# EAGLE board mycodo board 2.0 (EAGLE 9.6.2), part 1 of 2
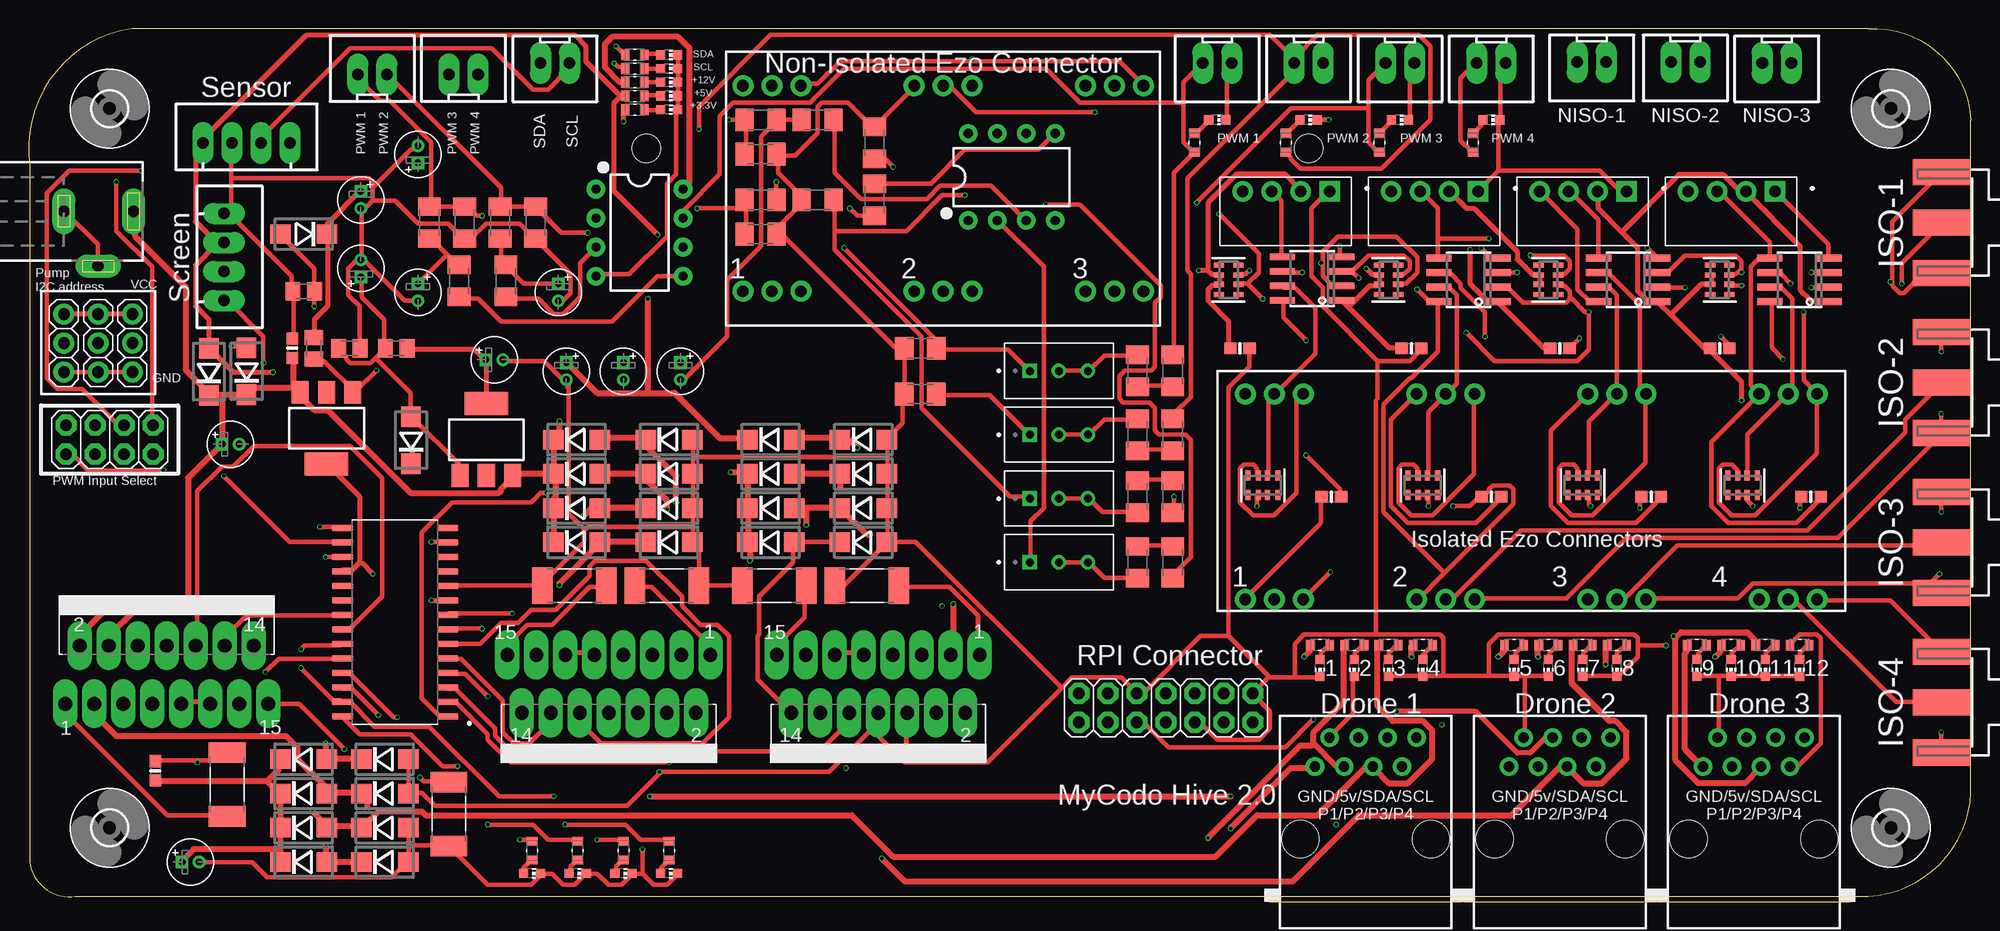
[diagram p2: board, top side]
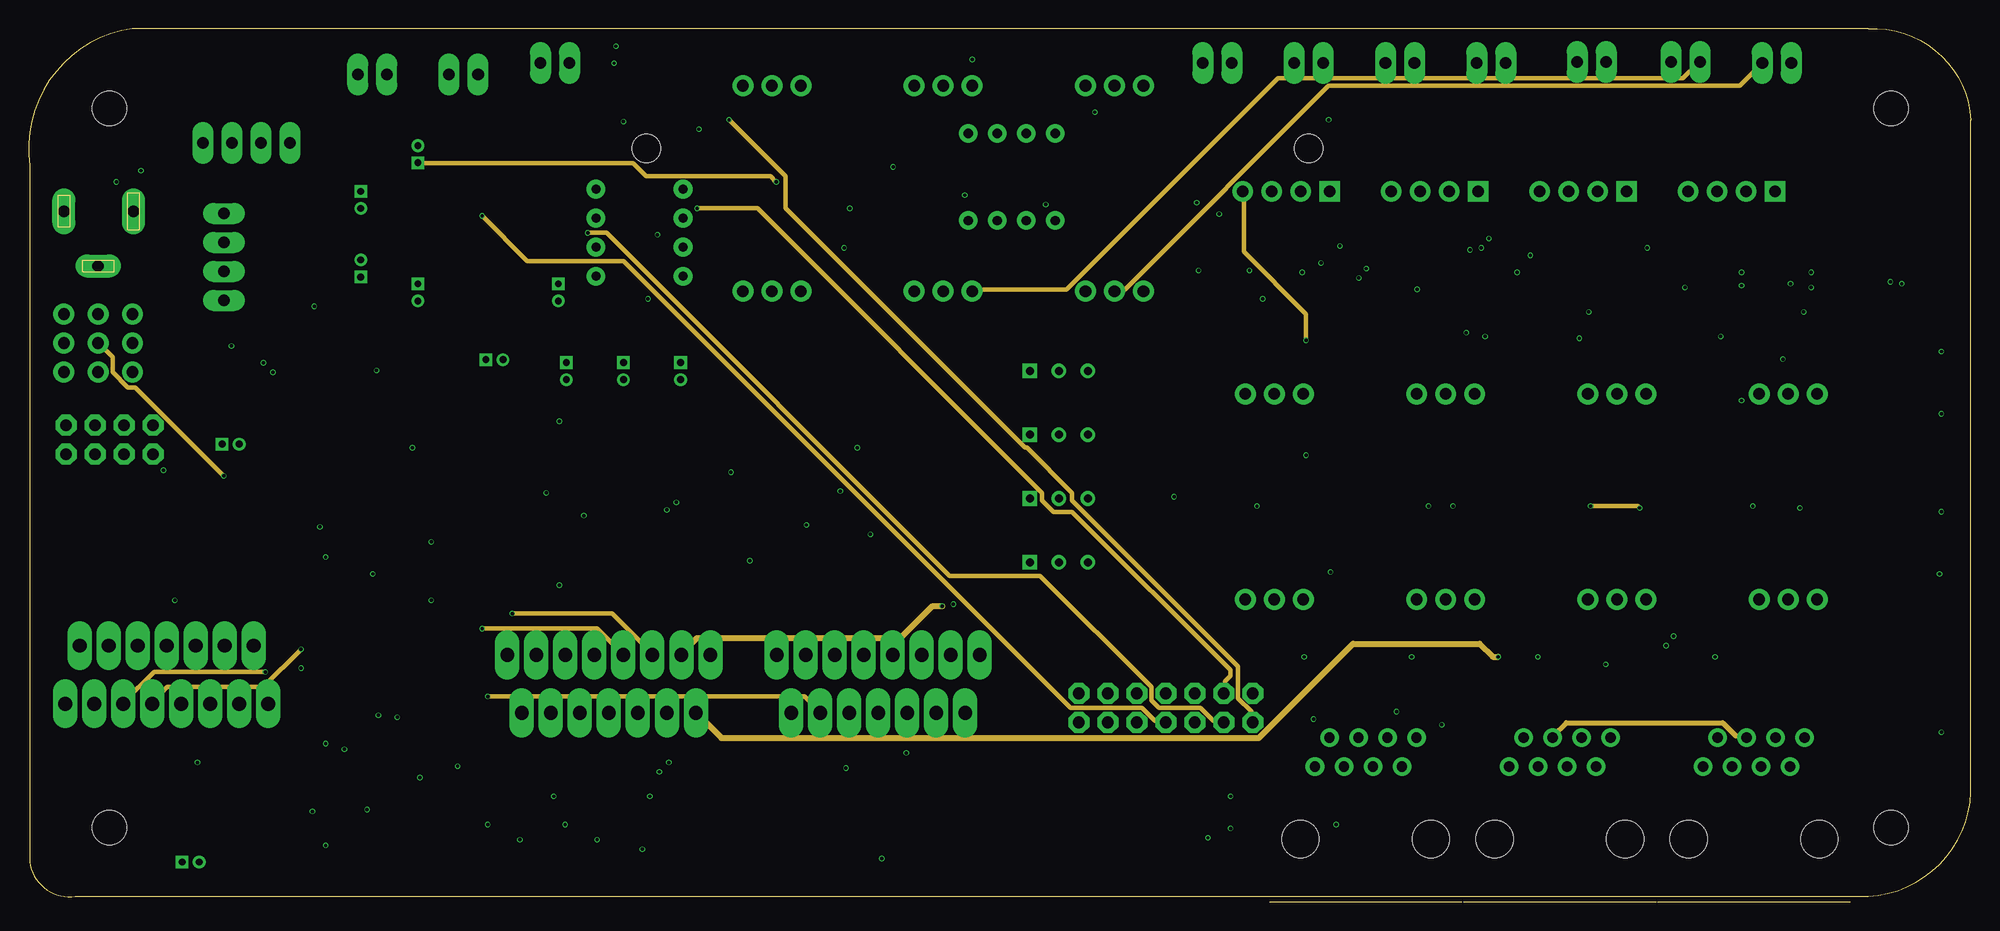
[diagram p3: board, inner layer Route2]
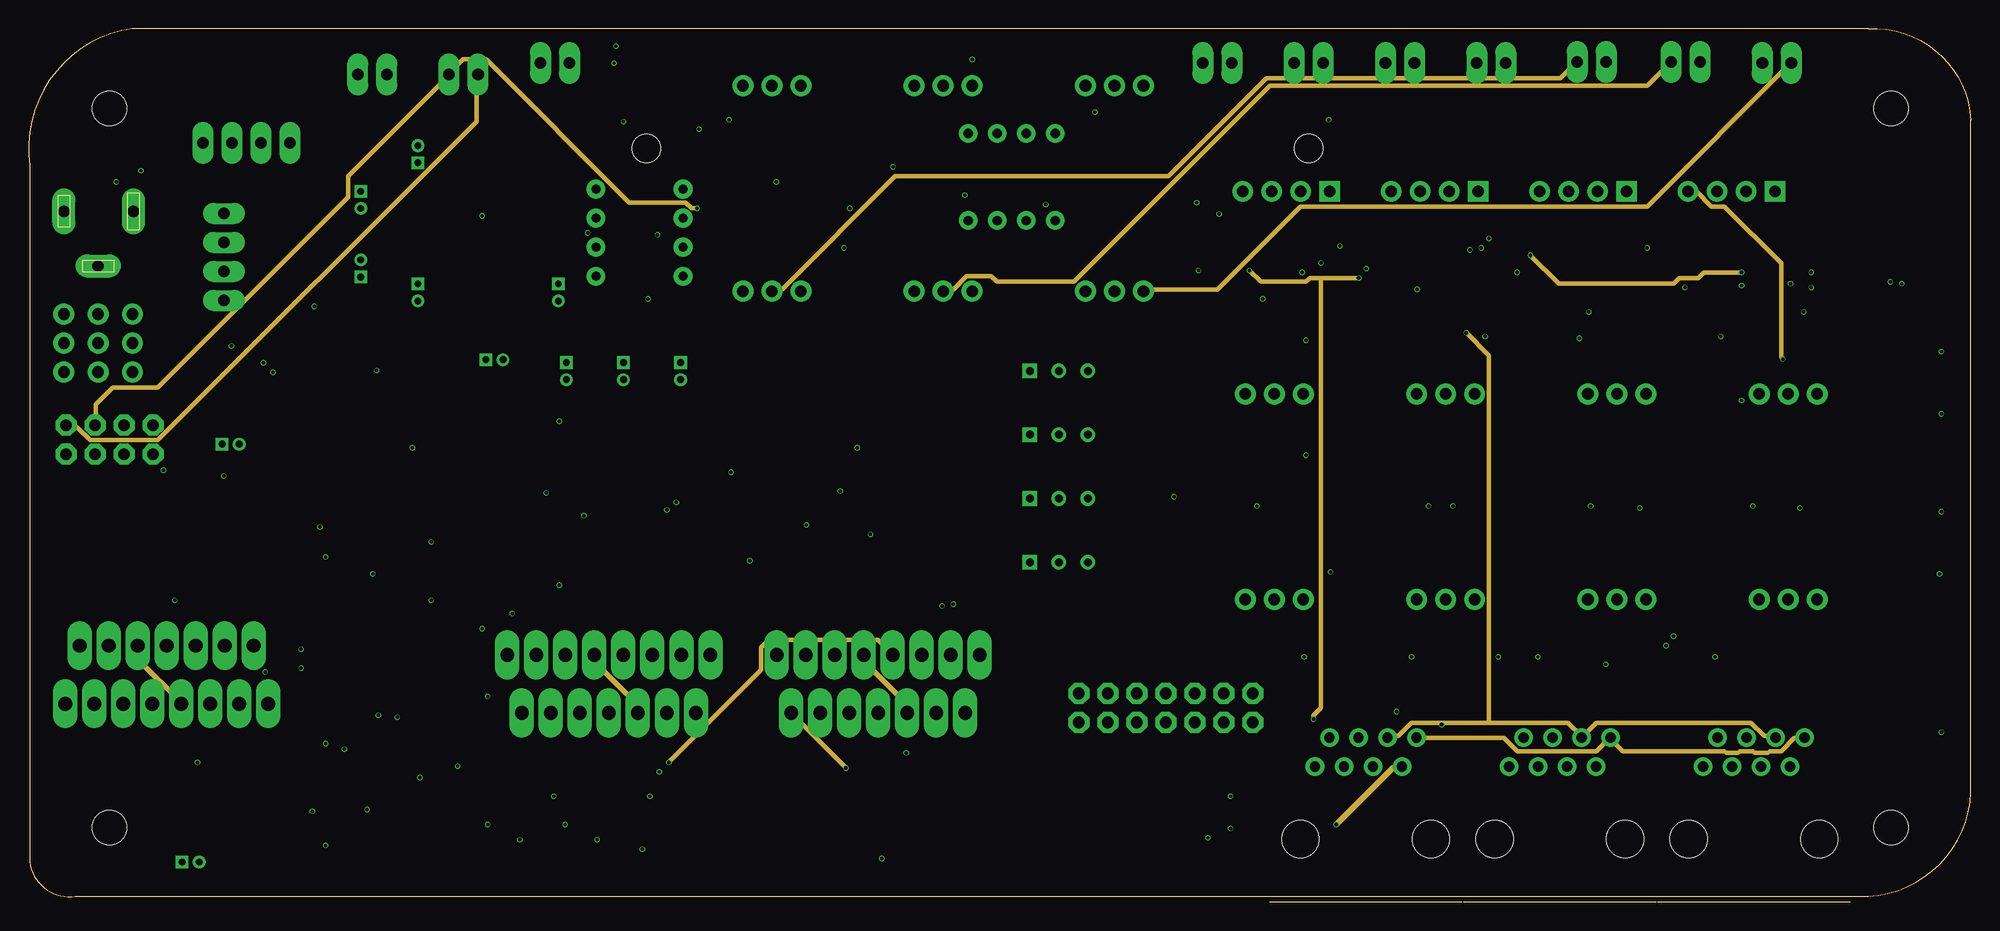
[diagram p4: board, inner layer Route15]
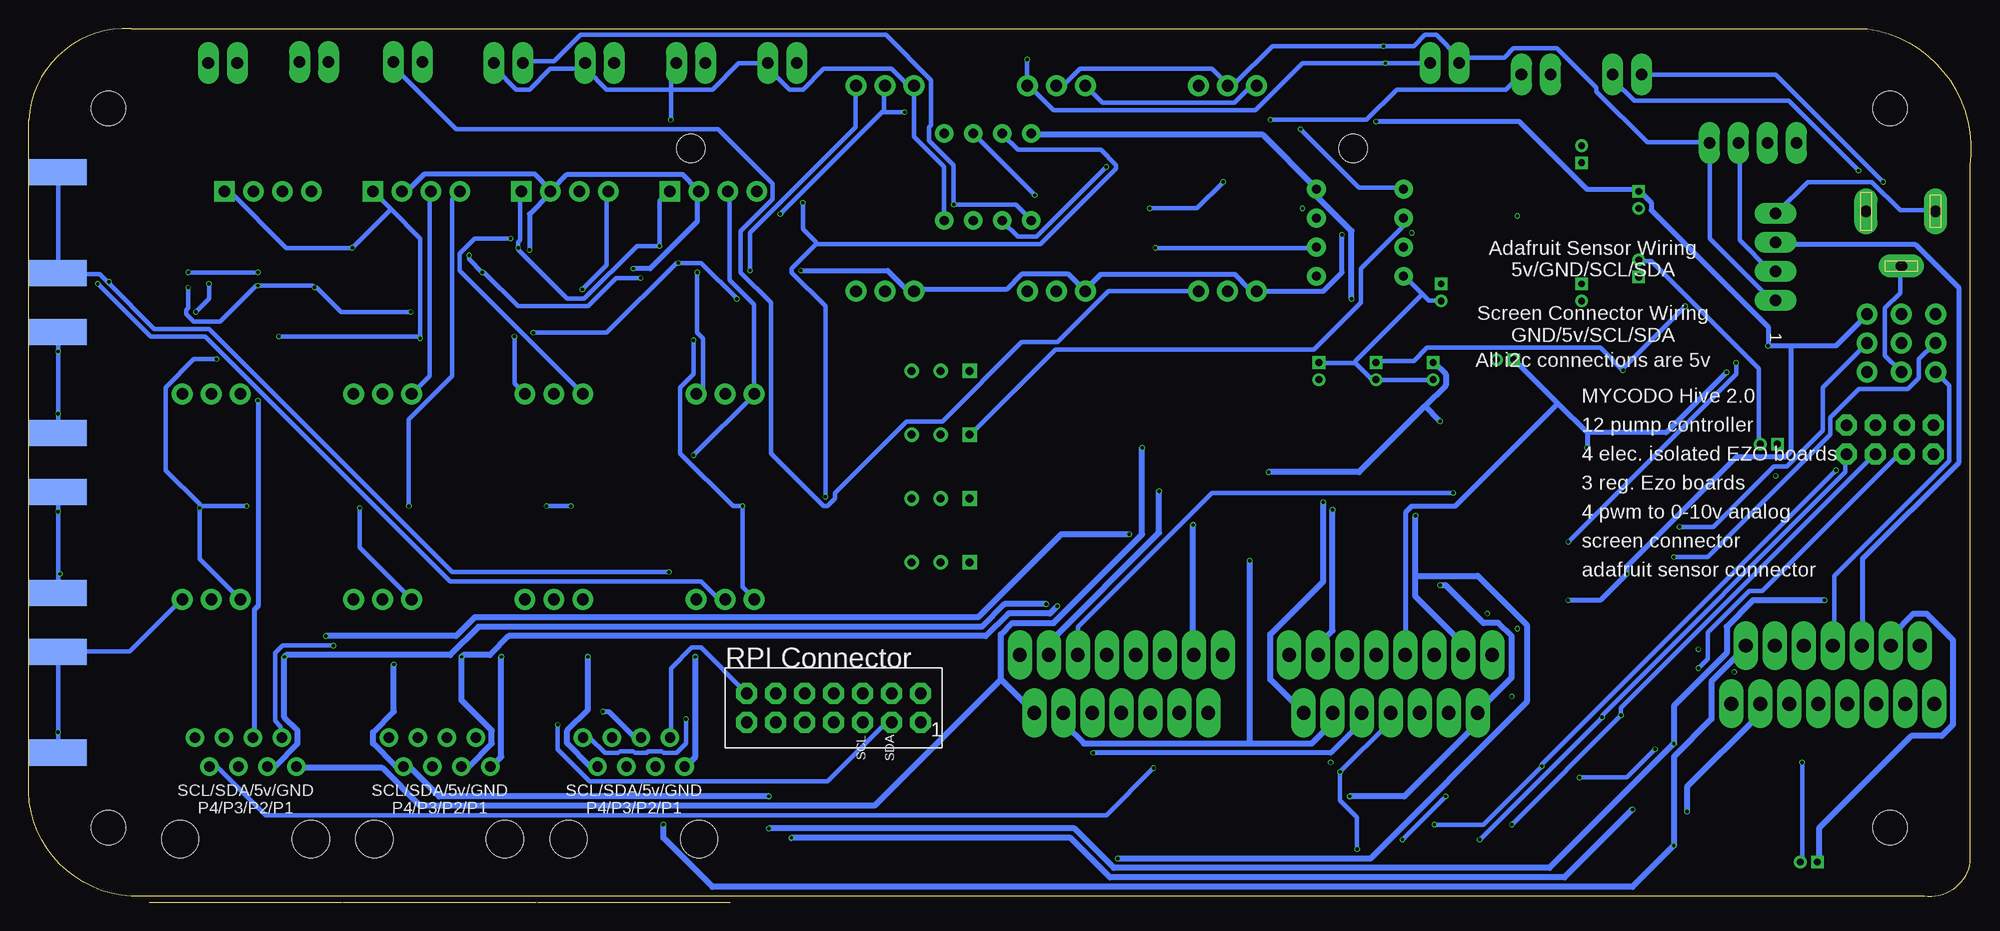
[diagram p5: board, bottom side, seen from below]

Size 170.1 x 76.04 mm. Coordinates in mm from the lower left corner, seen from the top.
Outline: 4.1,0.03 161.1,0.03 arc90 170.1,10.03 170.1,68.03 arc90 161.1,76.03 9.1,76.03 arc90 0.1,64.03 0.1,3.03 arc90 4.1,0.03
Copper layers (1+2*15+16): Top 0.035mm / dielectric 1.6mm / Route2 0.035mm / dielectric 0.15mm / Route15 0.035mm / dielectric 0.2mm / Bottom 0.035mm
Design rules "jlcpcb-2layers *": minimum track width 6mil, minimum drill 0.3mm, track to track 5mil, track to pad 5mil, pad to pad 5mil, via to via 5mil, smd to smd 5mil, copper to edge 0.2mm, drill to drill 6mil, minimum pad ring 10mil, minimum via ring 3mil, stop-mask expansion 4mil, vias tented up to drill 0mil, thermal gap 10mil
Net classes: 0 default: width 0.406 mm, drill 0.102 mm, clearance 0.254 mm; 1 Pump Out: width 0.508 mm, drill 0.102 mm, clearance 0.254 mm; 2 12v: width 0.508 mm, drill 0.102 mm, clearance 0.254 mm; 3 5v: width 0.457 mm, drill 0.102 mm, clearance 0.254 mm; 4 3.3v: width 0.457 mm, drill 0.102 mm, clearance 0.254 mm; 5 i2c: width 0.406 mm, drill 0.102 mm, clearance 0.254 mm; 6 GPIO: width 0.406 mm, drill 0.102 mm, clearance 0.254 mm; 8 New Class: drill 0.102 mm, clearance 0.152 mm
Holes 2.5 mm at 54.1,65.53 112.1,65.53

## Footprints (pad centres in the part's own frame; a part is rotated, then mirrored left to right if it is on the bottom)
RESC1608X60N = smd 0.762 x 0.94: 1 -0.838,0; 2 0.838,0
JST-XH-02-PACKAGE-LONG-PAD = drill 1.016 long: 1 -1.27,0; 2 1.27,0
E1,5-4 = drill 0.6 square: + -0.75,0 | drill 0.6: - 0.75,0
0603-NO = smd 1.075 x 1: 1 -0.85,0; 2 0.85,0
DO214BA = smd 1.8 x 1.7: A 2.05,0; C -2.05,0
3,0 = hole 3: 0,0
MULTIWATT-15 = drill 1.2 long: 1 -8.89,-7.62; 2 -7.62,-2.54; 3 -6.35,-7.62; 4 -5.08,-2.54; 5 -3.81,-7.62; 6 -2.54,-2.54; 7 -1.27,-7.62; 8 0,-2.54; 9 1.27,-7.62; 10 2.54,-2.54; 11 3.81,-7.62; 12 5.08,-2.54; 13 6.35,-7.62; 14 7.62,-2.54; 15 8.89,-7.62
SOT223 = smd 1.5 x 2: 1 -2.3,-3.15; 2 0,-3.15; 3 2.3,-3.15 | smd 3.8 x 2: 4 0,3.15
J502-ND-142-0701-801/806 = smd 5.08 x 2.286: 1 2.565,0; G@1 2.565,4.42; G@2 2.565,-4.42 | smd 5.08 x 2.286 bottom: G@3 2.565,4.42; G@4 2.565,-4.42
DCJ0202 = drill 1 pad 2 long: 1 0,3.1; 2 4.8,0; 3 0,-3
1X03-CLEANBIG = drill 1.016 pad 1.676: 1 -2.54,0; 2 0,0; 3 2.54,0
2X07 = drill 1.016 octagon: 1 -7.62,-1.27; 2 -7.62,1.27; 3 -5.08,-1.27; 4 -5.08,1.27; 5 -2.54,-1.27; 6 -2.54,1.27; 7 0,-1.27; 8 0,1.27; 9 2.54,-1.27; 10 2.54,1.27; 11 5.08,-1.27; 12 5.08,1.27; 13 7.62,-1.27; 14 7.62,1.27
2X04 = drill 1.016 octagon: 1 -3.81,-1.27; 2 -3.81,1.27; 3 -1.27,-1.27; 4 -1.27,1.27; 5 1.27,-1.27; 6 1.27,1.27; 7 3.81,-1.27; 8 3.81,1.27
CHIP-LED0603 = smd 0.8 x 0.8: A 0,-0.75; C 0,0.75
CONV_RFM-0505S = drill 1 square: 1 -3.85,-1.75 | drill 1: 2 -1.31,-1.75; 3 1.23,-1.75; 4 3.77,-1.75
RJ45-NO-SHIELD = drill 0.9 pad 1.4: 1 -4.445,6.35; 2 -3.175,8.89; 3 -1.905,6.35; 4 -0.635,8.89; 5 0.635,6.35; 6 1.905,8.89; 7 3.175,6.35; 8 4.445,8.89 | hole 3.251: -5.715,0; 5.715,0
R2512 = smd 1.8 x 3.2: 1 -2.8,0; 2 2.8,0
M1206 = smd 1.6 x 2: 1 -1.4,0; 2 1.4,0
TRIM_3296W-1-103 = drill 0.71 square: 1 -2.54,0 | drill 0.71: 2 0,0; 3 2.54,0
RESPACK_4X0603 = smd 0.45 x 0.9: 1 -1.3,-0.85; 2 -0.4,-0.85; 3 0.4,-0.85; 4 1.3,-0.85; 5 1.3,0.85; 6 0.4,0.85; 7 -0.4,0.85; 8 -1.3,0.85
M0805 = smd 1.3 x 1.6: 1 -0.95,0; 2 0.95,0
1X03 = drill 1.016: 1 -2.54,0; 2 0,0; 3 2.54,0
DIP08 = drill 0.813 pad 1.626: 1 -3.81,-3.81; 2 -1.27,-3.81; 3 1.27,-3.81; 4 3.81,-3.81; 5 3.81,3.81; 6 1.27,3.81; 7 -1.27,3.81; 8 -3.81,3.81
SOIC127P1030X265-28N = smd 1.9 x 0.6: 1 -4.605,8.255; 2 -4.605,6.985; 3 -4.605,5.715; 4 -4.605,4.445; 5 -4.605,3.175; 6 -4.605,1.905; 7 -4.605,0.635; 8 -4.605,-0.635; 9 -4.605,-1.905; 10 -4.605,-3.175; 11 -4.605,-4.445; 12 -4.605,-5.715; 13 -4.605,-6.985; 14 -4.605,-8.255; 15 4.605,-8.255; 16 4.605,-6.985; 17 4.605,-5.715; 18 4.605,-4.445; 19 4.605,-3.175; 20 4.605,-1.905; 21 4.605,-0.635; 22 4.605,0.635; 23 4.605,1.905; 24 4.605,3.175; 25 4.605,4.445; 26 4.605,5.715; 27 4.605,6.985; 28 4.605,8.255
JST-XH-04-PACKAGE-LONG-PAD = drill 1.016 long: 1 -3.81,0; 2 -1.27,0; 3 1.27,0; 4 3.81,0
SOIC8_150MIL = smd 0.6 x 2.2: 1 -1.905,-2.6; 2 -0.635,-2.6; 3 0.635,-2.6; 4 1.905,-2.6; 5 1.905,2.6; 6 0.635,2.6; 7 -0.635,2.6; 8 -1.905,2.6

## Placement (x,y rotation side)
3.3V  330R  [RESC1608X60N]  53.1,68.93 0 top
5V  330R  [RESC1608X60N]  53.1,70.13 0 top
12V  330R  [RESC1608X60N]  53.1,71.33 0 top
(0-10V)-1  jst-xh-2  [JST-XH-02-PACKAGE-LONG-PAD]  112.1,73.03 180 top
(0-10V)-2  jst-xh-2  [JST-XH-02-PACKAGE-LONG-PAD]  128.1,73.03 180 top
C1  100nF  [E1,5-4]  14.2,3.03 0 top
C1A1  1uf 50v  [E1,5-4]  34.1,52.93 270 top
C1A2  1uf 50v  [E1,5-4]  34.1,65.03 90 top
C1B1  1uf 50v  [E1,5-4]  46.4,52.93 270 top
C1B2  1uf 50v  [E1,5-4]  57.1,46.03 270 top
C2  100nF  [E1,5-4]  17.7,39.63 0 top
C3  100nF  [E1,5-4]  47.1,46.03 270 top
C4  0.1uF  [0603-NO]  128.1,35.03 0 top
C5  0.1uF  [0603-NO]  121.1,48.03 0 top
C6  0.1uF  [0603-NO]  114.1,35.03 0 top
C7  0.1uF  [0603-NO]  106.1,48.03 0 top
C8  0.1uF  [0603-NO]  142.1,35.03 0 top
C9  0.1uF  [0603-NO]  134.1,48.03 0 top
C10  0.1uF  [0603-NO]  156.1,35.03 0 top
C11  0.1uF  [0603-NO]  148.1,48.03 0 top
C13  1uF  [E1,5-4]  29.1,61.03 270 top
C14  10uF 35v  [E1,5-4]  52.1,46.03 270 top
C15  0.1uF  [0603-NO]  23.1,48.03 270 top
C16  1uF 50v  [E1,5-4]  40.8,47.03 0 top
C17  10uF 35v  [E1,5-4]  29.1,55.03 90 top
C18  0.1uF  [0603-NO]  11.1,11.03 270 top
D1  1N4004  [DO214BA]  24.1,12.03 0 top
D2  1N4004  [DO214BA]  24.1,9.03 0 top
D3  1N4004  [DO214BA]  24.1,6.03 0 top
D4  1N4004  [DO214BA]  24.1,3.03 0 top
D5  1N4004  [DO214BA]  31.2,12.03 0 top
D6  1N4004  [DO214BA]  31.2,9.03 0 top
D7  1N4004  [DO214BA]  31.2,6.03 0 top
D8  1N4004  [DO214BA]  31.2,3.03 0 top
D9  1N4004  [DO214BA]  48,40.03 0 top
D10  1N4004  [DO214BA]  48,37.03 0 top
D11  1N4004  [DO214BA]  48,34.03 0 top
D12  1N4004  [DO214BA]  48,31.03 0 top
D13  1N4004  [DO214BA]  56.1,40.03 0 top
D14  1N4004  [DO214BA]  56.1,37.03 0 top
D15  1N4004  [DO214BA]  56.1,34.03 0 top
D16  1N4004  [DO214BA]  56.1,31.03 0 top
D17  1N4004  [DO214BA]  65,40.03 0 top
D18  1N4004  [DO214BA]  65,37.03 0 top
D19  1N4004  [DO214BA]  65,34.03 0 top
D20  1N4004  [DO214BA]  65,31.03 0 top
D21  1N4004  [DO214BA]  73.1,40.03 0 top
D22  1N4004  [DO214BA]  73.1,37.03 0 top
D23  1N4004  [DO214BA]  73.1,34.03 0 top
D24  1N4004  [DO214BA]  73.1,31.03 0 top
D33  1N4002  [DO214BA]  15.8,45.98 90 top
D34  1N4002  [DO214BA]  33.5,39.98 90 top
D35  1N4004  [DO214BA]  24.1,58.03 180 top
D36  1N4004  [DO214BA]  19.1,46.03 90 top
H1  MOUNT-HOLE3.0  [3,0]  7.1,6.03 0 top
H2  MOUNT-HOLE3.0  [3,0]  163.1,6.03 0 top
H3  MOUNT-HOLE3.0  [3,0]  163.1,69.03 0 top
H4  MOUNT-HOLE3.0  [3,0]  7.1,69.03 0 top
IC1  L298  [MULTIWATT-15]  12.1,24.51 0 top
IC2  L298  [MULTIWATT-15]  50.82,13.55 180 top
IC3  L298  [MULTIWATT-15]  74.41,13.55 180 top
IC4  LM317MBSTT3  [SOT223]  26.1,41.03 180 top
IC5  LM317MBSTT3  [SOT223]  40.1,40.03 0 top
ISO-1  SMA Plug  [J502-ND-142-0701-801/806]  170.1,59.03 180 top
ISO-2  SMA Plug  [J502-ND-142-0701-801/806]  170.1,45.03 180 top
ISO-3  SMA Plug  [J502-ND-142-0701-801/806]  170.1,31.03 180 top
ISO-4  SMA Plug  [J502-ND-142-0701-801/806]  170.1,17.03 180 top
J1  DCJ0202  [DCJ0202]  6.1,60.03 270 top
JP1  [1X03-CLEANBIG]  80.1,53.03 0 top
JP2  [1X03-CLEANBIG]  65.1,53.03 0 top
JP3  [1X03-CLEANBIG]  80.1,71.03 180 top
JP4  [1X03-CLEANBIG]  65.1,71.03 180 top
JP5  [1X03-CLEANBIG]  95.1,53.03 0 top
JP6  [1X03-CLEANBIG]  95.1,71.03 180 top
JP7  [1X03-CLEANBIG]  109.1,44.03 180 top
JP8  [1X03-CLEANBIG]  109.1,26.03 0 top
JP9  [1X03-CLEANBIG]  124.1,44.03 180 top
JP10  [1X03-CLEANBIG]  124.1,26.03 0 top
JP11  [1X03-CLEANBIG]  139.1,44.03 180 top
JP12  [1X03-CLEANBIG]  139.1,26.03 0 top
JP13  [1X03-CLEANBIG]  154.1,44.03 180 top
JP14  [1X03-CLEANBIG]  154.1,26.03 0 top
JP15  [2X07]  99.6,16.53 0 top
JP19  [2X04]  7.1,40.03 180 top
LED1  [CHIP-LED0603]  56.1,73.73 270 top
LED2  [CHIP-LED0603]  56.1,72.53 270 top
LED4  [CHIP-LED0603]  56.1,71.33 270 top
LED5  [CHIP-LED0603]  56.1,70.13 270 top
LED6  [CHIP-LED0603]  56.1,68.93 270 top
LED7  [CHIP-LED0603]  113.1,20.03 180 top
LED8  [CHIP-LED0603]  116.1,20.03 180 top
LED9  [CHIP-LED0603]  119.1,20.03 180 top
LED10  [CHIP-LED0603]  122.1,20.03 180 top
LED11  [CHIP-LED0603]  130.1,20.03 180 top
LED12  [CHIP-LED0603]  133.1,20.03 180 top
LED13  [CHIP-LED0603]  136.1,20.03 180 top
LED14  [CHIP-LED0603]  139.1,20.03 180 top
LED15  [CHIP-LED0603]  146.1,20.03 180 top
LED16  [CHIP-LED0603]  149.1,20.03 180 top
LED17  [CHIP-LED0603]  152.1,20.03 180 top
LED18  [CHIP-LED0603]  155.1,20.03 180 top
LED19  [CHIP-LED0603]  104.1,68.03 270 top
LED20  [CHIP-LED0603]  44.1,2.03 270 top
LED21  [CHIP-LED0603]  112.1,68.03 270 top
LED22  [CHIP-LED0603]  120.1,68.03 270 top
LED23  [CHIP-LED0603]  48.1,2.03 270 top
LED24  [CHIP-LED0603]  128.1,68.03 270 top
LED25  [CHIP-LED0603]  52.1,2.03 270 top
LED27  [CHIP-LED0603]  56.1,2.03 270 top
PS1  RFM-0505S  [CONV_RFM-0505S]  110.1,60.03 180 top
PS2  RFM-0505S  [CONV_RFM-0505S]  123.1,60.03 180 top
PS3  RFM-0505S  [CONV_RFM-0505S]  136.1,60.03 180 top
PS4  RFM-0505S  [CONV_RFM-0505S]  149.1,60.03 180 top
PUMPBOX-1  RJ45-6L-B  [RJ45-NO-SHIELD]  117.1,5.03 0 top
PUMPBOX-2  RJ45-6L-B  [RJ45-NO-SHIELD]  134.1,5.03 0 top
PUMPBOX-3  RJ45-6L-B  [RJ45-NO-SHIELD]  151.1,5.03 0 top
R1  0,5 x 2W  [R2512]  36.8,7.23 90 top
R1A1  100kΩ  [M1206]  35.1,59.03 90 top
R1A2  100kΩ  [M1206]  64.1,61.03 180 top
R1B1  100kΩ  [M1206]  41.3,59.03 270 top
R1B2  100kΩ  [M1206]  64.1,68.03 0 top
R2  0,5 x 2W  [R2512]  17.4,9.83 270 top
R2A1  100kΩ  [M1206]  78.1,48.03 0 top
R2A2  100kΩ  [M1206]  69.1,61.03 0 top
R2B1  100kΩ  [M1206]  78.1,44.03 180 top
R2B2  100kΩ  [M1206]  74.1,66.03 90 top
R3  0,5 x 2W  [R2512]  47.8,27.23 0 top
R3-1A1  3296W-1-103  [TRIM_3296W-1-103]  90.23,46.05 0 top
R3-1A2  3296W-1-103  [TRIM_3296W-1-103]  90.23,34.87 0 top
R3-1B1  3296W-1-103  [TRIM_3296W-1-103]  90.23,40.46 0 top
R3-1B2  3296W-1-103  [TRIM_3296W-1-103]  90.23,29.28 0 top
R3-2A1  180KΩ  [M1206]  97.1,46.05 270 top
R3-2A2  180KΩ  [M1206]  97.1,35.03 90 top
R3-2B1  180KΩ  [M1206]  97.1,40.46 270 top
R3-2B2  180KΩ  [M1206]  97.1,29.28 90 top
R3-3A1  15kΩ  [M1206]  100.2,46.05 90 top
R3-3A2  15kΩ  [M1206]  100.2,35.03 270 top
R3-3B1  15kΩ  [M1206]  100.2,40.46 90 top
R3-3B2  15kΩ  [M1206]  100.2,29.28 270 top
R4  0,5 x 2W  [R2512]  55.9,27.23 180 top
R4A1  75kΩ  [M1206]  37.7,53.93 270 top
R4A2  75kΩ  [M1206]  74.1,61.03 90 top
R4B1  75kΩ  [M1206]  41.8,53.93 270 top
R4B2  75kΩ  [M1206]  69.1,68.03 0 top
R5  0,5 x 2W  [R2512]  65.3,27.23 0 top
R5A1  10kΩ  [M1206]  38.2,59.03 270 top
R5A2  10kΩ  [M1206]  64.1,58.03 0 top
R5B1  10kΩ  [M1206]  44.4,59.03 270 top
R5B2  10kΩ  [M1206]  64.1,65.03 0 top
R6  0,5 x 2W  [R2512]  73.4,27.23 0 top
R7  10K  [RESPACK_4X0603]  119.1,54.03 90 top
R8  10K  [RESPACK_4X0603]  122.1,36.03 180 top
R9  10K  [RESPACK_4X0603]  105.1,54.03 90 top
R10  10K  [RESPACK_4X0603]  108.1,36.03 180 top
R11  10K  [RESPACK_4X0603]  133.1,54.03 90 top
R12  10K  [RESPACK_4X0603]  136.1,36.03 180 top
R13  10K  [RESPACK_4X0603]  148.1,54.03 90 top
R14  10K  [RESPACK_4X0603]  150.1,36.03 180 top
R15  240Ω  [M0805]  25,48.03 90 top
R16  394Ω  [M0805]  24.1,53.03 0 top
R17  240Ω  [M0805]  32.2,48.03 0 top
R18  720Ω  [M0805]  28.1,48.03 180 top
R20  330R  [RESC1608X60N]  113.1,22.03 0 top
R21  330R  [RESC1608X60N]  116.1,22.03 0 top
R22  330R  [RESC1608X60N]  119.1,22.03 0 top
R23  330R  [RESC1608X60N]  122.1,22.03 0 top
R24  330R  [RESC1608X60N]  130.1,22.03 0 top
R25  330R  [RESC1608X60N]  133.1,22.03 0 top
R26  330R  [RESC1608X60N]  136.1,22.03 0 top
R27  330R  [RESC1608X60N]  139.1,22.03 0 top
R28  330R  [RESC1608X60N]  146.1,22.03 0 top
R29  330R  [RESC1608X60N]  149.1,22.03 0 top
R30  330R  [RESC1608X60N]  152.1,22.03 0 top
R31  330R  [RESC1608X60N]  155.1,22.03 0 top
R32  330R  [RESC1608X60N]  102.1,66.03 90 top
R33  330R  [RESC1608X60N]  44.1,4.03 270 top
R34  330R  [RESC1608X60N]  110.1,66.03 90 top
R35  330R  [RESC1608X60N]  118.3,66.03 90 top
R36  330R  [RESC1608X60N]  48.1,4.03 270 top
R37  330R  [RESC1608X60N]  126.5,66.03 90 top
R38  330R  [RESC1608X60N]  52.1,4.03 270 top
R40  330R  [RESC1608X60N]  56.1,4.03 270 top
SCL  330R  [RESC1608X60N]  53.1,72.53 0 top
SDA  33R  [RESC1608X60N]  53.1,73.73 0 top
SJ1  [1X03]  3.1,48.49 90 top
SJ2  [1X03]  6.1,48.49 90 top
SJ3  [1X03]  9.1,48.49 90 top
U1  LM358  [DIP08]  86.1,63.03 0 top
U2  LM358  [DIP08]  53.51,58.16 270 top
U3  MCP23017-E/SO  [SOIC127P1030X265-28N]  32.1,24.03 180 top
X3  jst-xh-2  [JST-XH-02-PACKAGE-LONG-PAD]  120.1,73.03 180 top
X4  jst-xh-2  [JST-XH-02-PACKAGE-LONG-PAD]  104.1,73.03 180 top
X5  PWM-IN  [JST-XH-02-PACKAGE-LONG-PAD]  30.1,72.03 0 top
X6  4-pin-header  [JST-XH-04-PACKAGE-LONG-PAD]  19.1,66.03 0 top
X7  4-pin-header  [JST-XH-04-PACKAGE-LONG-PAD]  17.1,56.03 270 top
X8  PWM-IN  [JST-XH-02-PACKAGE-LONG-PAD]  38.1,72.03 0 top
X11  jst-xh-2  [JST-XH-02-PACKAGE-LONG-PAD]  145.1,73.11 180 top
X12  jst-xh-2  [JST-XH-02-PACKAGE-LONG-PAD]  136.9,73.11 180 top
X13  ISO154X  [SOIC8_150MIL]  112.4,54.14 90 top
X14  ISO154X  [SOIC8_150MIL]  126.1,54.03 90 top
X16  ISO154X  [SOIC8_150MIL]  140.1,54.03 90 top
X18  ISO154X  [SOIC8_150MIL]  155.1,54.03 90 top
X20  jst-xh-2  [JST-XH-02-PACKAGE-LONG-PAD]  153.1,73.03 180 top
X21  jst-xh-2  [JST-XH-02-PACKAGE-LONG-PAD]  46.1,73.03 180 top